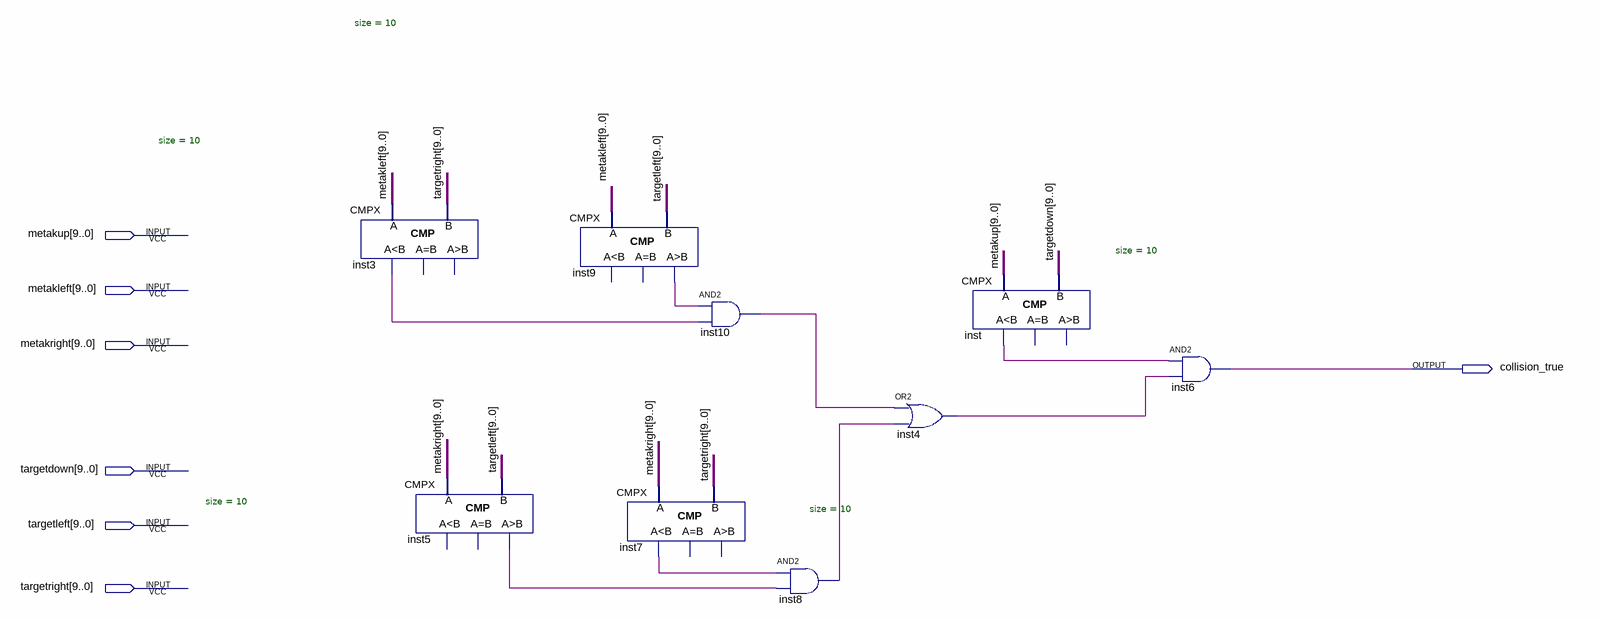
[diagram p0: schematic sheet]
// Quartus schematic kolizija.bdf as structural Verilog: 9 symbols, 7 pins
module kolizija (
  input  [9:0] metakup,
  input  [9:0] metakleft,
  input  [9:0] metakright,
  input  [9:0] targetdown,
  input  [9:0] targetleft,
  input  [9:0] targetright,
  output collision_true
);

  wire inst3_ls, inst4_out, inst5_gr, inst7_ls, inst8_out, inst9_gr, inst10_out, inst_ls;

  CMPX #(.size(10)) inst3 (.A(metakleft), .B(targetright), .ls(inst3_ls));  // open: eq, gr
  CMPX #(.size(10)) inst5 (.A(metakright), .B(targetleft), .gr(inst5_gr));  // open: ls, eq
  CMPX #(.size(10)) inst9 (.A(metakleft), .B(targetleft), .gr(inst9_gr));  // open: ls, eq
  CMPX #(.size(10)) inst7 (.A(metakright), .B(targetright), .ls(inst7_ls));  // open: eq, gr
  and inst10 (inst10_out, inst9_gr, inst3_ls);
  and inst8 (inst8_out, inst7_ls, inst5_gr);
  or inst4 (inst4_out, inst10_out, inst8_out);
  CMPX #(.size(10)) inst (.A(metakup), .B(targetdown), .ls(inst_ls));  // open: eq, gr
  and inst6 (collision_true, inst_ls, inst4_out);
endmodule
